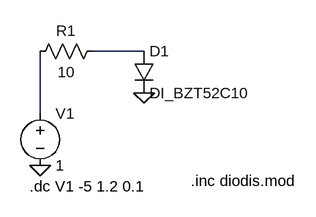
[diagram p0: schematic simulacion_zener.asc]
simulacion_zener.asc, the LTspice schematic file:
Version 4
SHEET 1 880 680
WIRE 240 32 160 32
WIRE 80 128 80 32
FLAG 80 208 0
FLAG 240 96 0
SYMBOL voltage 80 112 R0
SYMATTR InstName V1
SYMATTR Value 1
SYMBOL res 176 16 R90
WINDOW 0 0 56 VBottom 2
WINDOW 3 32 56 VTop 2
SYMATTR InstName R1
SYMATTR Value 10
SYMBOL diode 224 32 R0
SYMATTR InstName D1
SYMATTR Value DI_BZT52C10
TEXT 64 240 Left 2 !.dc V1 -5 1.2 0.1
TEXT 312 232 Left 2 !.inc diodis.mod

The netlist it stands for:
* simulacion_zener.asc
V1 N002 0 1
R1 N001 N002 10
D1 N001 0 DI_BZT52C10
.model D D
.lib standard.dio
.dc V1 -5 1.2 0.1
.inc diodis.mod
.backanno
.end